# Altium schematic sheet LEDMiniCube_Main.SchDoc
size A4
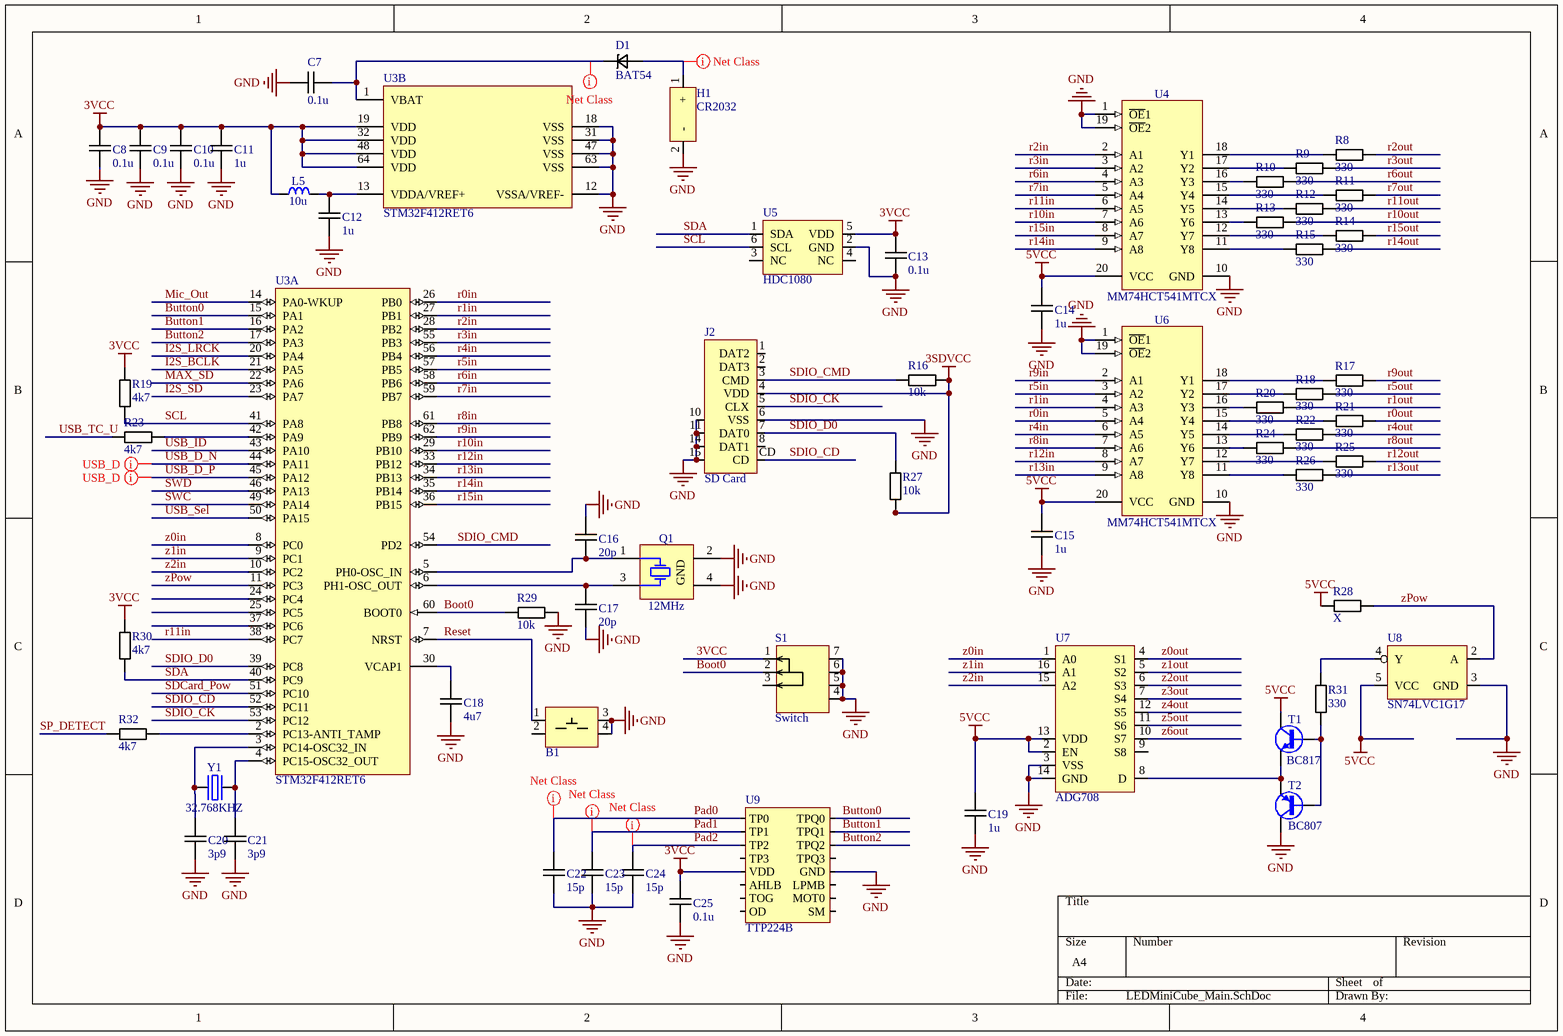
[diagram p0: LEDMiniCube_Main.SchDoc]

## Parts
B1  Button 5.2  [Button 5.2x5.2]  (value not drawn)
C7  0.1u  [CAPC1608L]
C8  0.1u  [CAPC1608L]
C9  0.1u  [CAPC1608L]
C10  0.1u  [CAPC1608L]
C11  1u  [CAPC1608L]
C12  1u  [CAPC1608L]
C13  0.1u  [CAPC1608L]
C14  1u  [CAPC2012L]
C15  1u  [CAPC2012L]
C16  20p  [CAPC1608L]
C17  20p  [CAPC1608L]
C18  4u7  [CAPC2012L]
C19  1u  [CAPC2012L]
C20  3p9  [CAPC1608L]
C21  3p9  [CAPC1608L]
C22  15p  [CAPC1608L]
C23  15p  [CAPC1608L]
C24  15p  [CAPC1608L]
C25  0.1u  [CAPC1608L]
D1  BAT54  [SOD-323F]
H1  CR2032  [Battery Holder cr2032]
J2  SD Card  [XUNPU TF-115]
L5  10u  [IND_ABRACON_AISC-0603]
Q1  12MHz  [XTAL_TXC_7M]
R8  330  [RESC2012L]
R9  330  [RESC2012L]
R10  330  [RESC2012L]
R11  330  [RESC2012L]
R12  330  [RESC2012L]
R13  330  [RESC2012L]
R14  330  [RESC2012L]
R15  330  [RESC2012L]
R16  10k  [RESC1608L]
R17  330  [RESC2012L]
R18  330  [RESC2012L]
R19  4k7  [RESC1608L]
R20  330  [RESC2012L]
R21  330  [RESC2012L]
R22  330  [RESC2012L]
R23  4k7  [RESC1608L]
R24  330  [RESC2012L]
R25  330  [RESC2012L]
R26  330  [RESC2012L]
R27  10k  [RESC1608L]
R28  X  [RESC1608L]
R29  10k  [RESC1608L]
R30  4k7  [RESC1608L]
R31  330  [RESC1608L]
R32  4k7  [RESC1608L]
S1  Switch  [TA-3524A-A1]
T1  BC817  [SOT95P230X110-3N]
T2  BC807  [SOT95P230X110-3N]
U3  STM32F412RET6  [STM-LQFP64_N]  (parts A,B of 2)
U4  MM74HCT541MTCX  [TSOP65P640X120-20N]
U5  HDC1080  [WSON HDC1080]
U6  MM74HCT541MTCX  [TSOP65P640X120-20N]
U7  ADG708  [TSOP65P640X110-16N]
U8  SN74LVC1G17  [SOT23-5AL]
U9  TTP224B  [SOP65P640-16L]
Y1  32.768KHZ  [XTAL_ABRACON_ABS09]

## Nets
3SDVCC: J2.4(VDD) R16.2 R27.1
3VCC: C8.2 C9.2 C10.2 C11.2 C13.2 C25.2 L5.1 R19.2 R30.2 S1.1 U3.19(VDD) U3.32(VDD) U3.48(VDD) U3.64(VDD) U5.5(VDD) U9.6(VDD)
5VCC: C14.2 C15.2 C19.2 R28.2 T1.3(C) U4.20(VCC) U6.20(VCC) U7.2(EN) U7.13(VDD) U8.5(VCC)
GND: B1.3 B1.4 C7.2 C8.1 C9.1 C10.1 C11.1 C12.1 C13.1 C14.1 C15.1 C16.2 C17.1 C18.1 C19.1 C20.1 C21.1 C22.1 C23.1 C24.1 C25.1 H1.2(-) J2.6(VSS) J2.10 J2.11 J2.14 J2.15 Q1.2(GND) Q1.4(GND) R29.2 S1.4 S1.5 S1.6 S1.7 T2.3(C) U3.12(VSSA/VREF-) U3.18(VSS) U3.31(VSS) U3.47(VSS) U3.63(VSS) U4.1(~{OE}1) U4.10(GND) U4.19(~{OE}2) U5.2(GND) U6.1(~{OE}1) U6.10(GND) U6.19(~{OE}2) U7.3(VSS) U7.14(GND) U8.3(GND) U9.10(GND)
Boot0: R29.1 S1.2 U3.60(BOOT0)
Button0: U3.15(PA1) U9.16(TPQ0)
Button1: U3.16(PA2) U9.15(TPQ1)
Button2: U3.17(PA3) U9.14(TPQ2)
I2S_BCLK: U3.21(PA5)
I2S_LRCK: U3.20(PA4)
I2S_SD: U3.23(PA7)
MAX_SD: U3.22(PA6)
Mic_Out: U3.14(PA0-WKUP)
Pad0: C22.2 U9.1(TP0)
Pad1: C23.2 U9.2(TP1)
Pad2: C24.2 U9.3(TP2)
r0in: U3.26(PB0) U6.5(A4)
r0out: R21.2
r1in: U3.27(PB1) U6.4(A3)
r1out: R20.2
r2in: U3.28(PB2) U4.2(A1)
r2out: R8.2
r3in: U3.55(PB3) U4.3(A2)
r3out: R9.2
r4in: U3.56(PB4) U6.6(A5)
r4out: R22.2
r5in: U3.57(PB5) U6.3(A2)
r5out: R18.2
r6in: U3.58(PB6) U4.4(A3)
r6out: R10.2
r7in: U3.59(PB7) U4.5(A4)
r7out: R11.2
r8in: U3.61(PB8) U6.7(A6)
r8out: R24.2
r9in: U3.62(PB9) U6.2(A1)
r9out: R17.2
r10in: U3.29(PB10) U4.7(A6)
r10out: R13.2
r11in: U3.38(PC7) U4.6(A5)
r11out: R12.2
r12in: U3.33(PB12) U6.8(A7)
r12out: R25.2
r13in: U3.34(PB13) U6.9(A8)
r13out: R26.2
r14in: U3.35(PB14) U4.9(A8)
r14out: R15.2
r15in: U3.36(PB15) U4.8(A7)
r15out: R14.2
Reset: B1.1 U3.7(NRST)
SCL: R19.1 U3.41(PA8) U5.6(SCL)
SDA: R30.1 U3.40(PC9) U5.1(SDA)
SDCard_Pow: U3.51(PC10)
SDIO_CD: J2.CD U3.52(PC11)
SDIO_CK: J2.5(CLX) U3.53(PC12)
SDIO_CMD: J2.3(CMD) R16.1 U3.54(PD2)
SDIO_D0: J2.7(DAT0) R27.2 U3.39(PC8)
SP_DETECT: R32.1
SWC: U3.49(PA14)
SWD: U3.46(PA13)
USB_D_N: U3.44(PA11)
USB_D_P: U3.45(PA12)
USB_ID: U3.43(PA10)
USB_Sel: U3.50(PA15)
USB_TC_U: R23.1
z0in: U3.8(PC0) U7.1(A0)
z0out: U7.4(S1)
z1in: U3.9(PC1) U7.16(A1)
z1out: U7.5(S2)
z2in: U3.10(PC2) U7.15(A2)
z2out: U7.6(S3)
z3out: U7.7(S4)
z4out: U7.12(S5)
z5out: U7.11(S6)
z6out: U7.10(S7)
zPow: R28.1 U3.11(PC3) U8.2(A)
NetC7_1: C7.1 D1.2 U3.1(VBAT)
NetC12_2: C12.2 L5.2 U3.13(VDDA/VREF+)
NetC16_1: C16.1 Q1.1(X) U3.5(PH0-OSC_IN)
NetC17_2: C17.2 Q1.3(X) U3.6(PH1-OSC_OUT)
NetC18_2: C18.2 U3.30(VCAP1)
NetC20_2: C20.2 U3.3(PC14-OSC32_IN) Y1.1(OSC1)
NetC21_2: C21.2 U3.4(PC15-OSC32_OUT) Y1.2(OSC2)
NetD1_1: D1.1 H1.1(+)
NetR8_1: R8.1 U4.18(Y1)
NetR9_1: R9.1 U4.17(Y2)
NetR10_1: R10.1 U4.16(Y3)
NetR11_1: R11.1 U4.15(Y4)
NetR12_1: R12.1 U4.14(Y5)
NetR13_1: R13.1 U4.13(Y6)
NetR14_1: R14.1 U4.12(Y7)
NetR15_1: R15.1 U4.11(Y8)
NetR17_1: R17.1 U6.18(Y1)
NetR18_1: R18.1 U6.17(Y2)
NetR20_1: R20.1 U6.16(Y3)
NetR21_1: R21.1 U6.15(Y4)
NetR22_1: R22.1 U6.14(Y5)
NetR23_2: R23.2 U3.42(PA9)
NetR24_1: R24.1 U6.13(Y6)
NetR25_1: R25.1 U6.12(Y7)
NetR26_1: R26.1 U6.11(Y8)
NetR31_1: R31.1 T1.1(B) T2.1(B)
NetR31_2: R31.2 U8.4(Y)
NetR32_2: R32.2 U3.2(PC13-ANTI_TAMP)
NetT1_2: T1.2(E) T2.2(E) U7.8(D)

Not connected (* = marked no-connect by the designer): B1 2; J2 1(DAT2) 2(DAT3) 8(DAT1); S1 3; U3 24(PC4) 25(PC5) 37(PC6); U5 3(NC) 4(NC); U7 9(S8); U9 4(TP3) 5(AHLB) 7(TOG) 8(LPMB) 9(MOT0) 11(OD) 12(SM) 13(TPQ3)

## Layout directives
differential pair: USB_D_N, USB_D_P
net class Clearance5; rule Clearance Constraint [Generic clearance = 0.15mm, and 30 value(s) for objects]: NetD1_1
net class Clearance5; rule Clearance Constraint [Generic clearance = 0.15mm, and 21 value(s) for objects]: NetC7_1
net class Clearance5: Pad0, Pad1, Pad2

## Library data of the parts
C7-C25 = Capacitor: Name: *; Case: *
  C7-C10 C13 C25: Value: 0.1u
  C11 C12 C14 C15 C19: Value: 1u
  C16 C17: Value: 20p
  C18: Value: 4u7
  C20 C21: Value: 3p9
  C22-C24: Value: 15p
D1 = Schotky: Name: BAT54; Case: *; Value: *
J2 = SD Card Socket: Name: SD Card
L5 = IND_390NH_5%_ABRACON_AISC-0603: Inductor; Value: 10u; Author: CERN DEM JLC
Q1 = XTAL_12MHZ_TXC_7M-12.000MAAJ-T: Crystal 4 pins 1=XTAL Control 2=GND3=XTAL 4=GND; Part Description: ±30ppm 18pF -20°C to +70°C  4 Pins, 3.2x2.5X0.8mm, SMD Sealing Crystal, 7M Series; Manufacturer: TXC CORPORATION; PressFit: No; Bonding: No; Part Number: XTAL_12MHZ_TXC_7M-12.000MAAJ-T; Component Kind: Standard; Component Type: Standard; PackageDescription: 4 Pins, 2.5x3.2mm, SMD Sealing Crystal, 7M Serie; Value: 12MHz; Manufacturer Part Number: 7M-12.000MAAJ-T; Pin Count: 4; Mounted: Yes; Socket: No; SMD: Yes; Sense: No; ComponentHeight: 0.8mm; HelpURL: \\cern.ch\dfs\Applications\Altium\Datasheets\XTAL_TXC_7M.pdf; Author: CERN DEM JLC; CreateDate: 19.06.2012; LatestRevisionDate: 19.06.2012
R8-R32 = Resistor: Model: *; Case: *
  R8-R15 R17 R18 R20-R22 R24-R26 R31: Value: 330
  R16 R27 R29: Value: 10k
  R19 R23 R30 R32: Value: 4k7
  R28: Value: X
T1 = BC817: NPN Transistor; Part Number: BC817-40; Device: BC817; Author: CERN DEM JLC
T2 = BC807-25: PNP Transistor; Part Number: BC807-40; Device: BC807; Author: CERN DEM JLC
U3 = STM32F401RBT6: ARM Cortex-M4 32-bit MCU+FPU, 105 DMIPS, 128 kB Flash, 64 kB Internal RAM, 48 I/Os, 64-pin LQFP, -40 to 85 degC, Tray; PartNumber: STM32F412RET6
U4 U6 = 74541: Octal Buffer/Line Driver with 3-State Outputs; Device: MM74HCT541MTCX
U7 = ADG708: Part: ADG708BRUZ; Name: ADG708
U8 = SN74LVC1G04: Part: SN74LVC1G17DBVR; Name: SN74LVC1G17
U9 = TTP224: Name: TTP224B
Y1 = XTAL_32.768KHZ_ABRACON_ABS09-32.768KHZ-T: Quartz Crystal; Part Description: Tolerance: ±20ppm, Stability: ±5ppm, -40°C to +85°C, 12.5pF, SMD Low Profile Crystal, ABS09 Series; PressFit: No; Bonding: No; Part Number: XTAL_32.768KHZ_ABRACON_ABS09-32.768KHZ-T; Component Kind: Standard; Component Type: Standard; PackageDescription: 2 Pins, 4.1x1.5mm, SMD Low Profile Crystal, ABS09 Serie; Value: 32.768KHZ; Manufacturer: ABRACON; Manufacturer Part Number: ABS09-32.768KHZ-T; Pin Count: 2; Mounted: Yes; Socket: No; SMD: Yes; Sense: No; ComponentHeight: 0.9mm; HelpURL: \\cern.ch\dfs\Applications\Altium\Datasheets\XTAL_ABRACON_ABS09.pdf; Author: CERN DEM JLC; CreateDate: 16.10.2014; LatestRevisionDate: 16.10.2014
H1 = CR2032: Name: CR2032; Part: *
S1 = Switch: Name: Switch
U5 = HDC1080: Name: HDC1080; Part: *